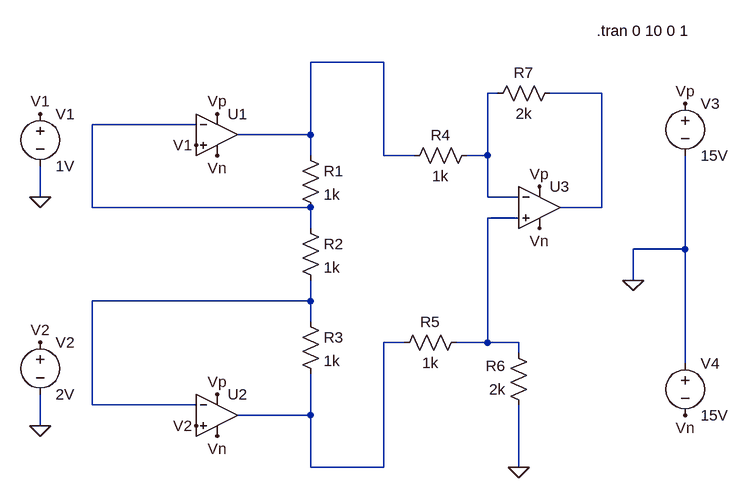
[diagram p0: schematic exp3.asc]
exp3.asc, the LTspice schematic file:
Version 4
SHEET 1 1000 680
WIRE 464 -64 352 -64
WIRE 640 -16 624 -16
WIRE 800 -16 720 -16
WIRE 176 32 16 32
WIRE 352 48 352 -64
WIRE 352 48 240 48
WIRE 352 80 352 48
WIRE 464 80 464 -64
WIRE 512 80 464 80
WIRE 624 80 624 -16
WIRE 624 80 592 80
WIRE -64 144 -64 96
WIRE 624 144 624 80
WIRE 672 144 624 144
WIRE 16 160 16 32
WIRE 352 160 16 160
WIRE 800 160 800 -16
WIRE 800 160 736 160
WIRE 672 176 624 176
WIRE 352 192 352 160
WIRE 928 224 928 80
WIRE 928 224 848 224
WIRE 848 272 848 224
WIRE 352 304 352 272
WIRE 352 304 16 304
WIRE 352 336 352 304
WIRE 496 368 464 368
WIRE 624 368 624 176
WIRE 624 368 576 368
WIRE 672 368 624 368
WIRE 672 384 672 368
WIRE 928 400 928 224
WIRE 16 464 16 304
WIRE 176 464 16 464
WIRE 352 480 352 416
WIRE 352 480 240 480
WIRE -64 496 -64 448
WIRE 352 560 352 480
WIRE 464 560 464 368
WIRE 464 560 352 560
WIRE 672 560 672 464
FLAG -64 144 0
FLAG -64 496 0
FLAG 672 560 0
FLAG 848 272 0
FLAG -64 16 V1
FLAG -64 368 V2
FLAG 208 16 Vp
FLAG 208 448 Vp
FLAG 928 0 Vp
FLAG 704 128 Vp
FLAG 208 80 Vn
FLAG 208 512 Vn
FLAG 704 192 Vn
FLAG 928 480 Vn
FLAG 176 64 V1
FLAG 176 496 V2
SYMBOL voltage -64 0 R0
WINDOW 123 0 0 Left 0
WINDOW 39 0 0 Left 0
SYMATTR InstName V1
SYMATTR Value 1V
SYMBOL voltage -64 352 R0
WINDOW 123 0 0 Left 0
WINDOW 39 0 0 Left 0
SYMATTR InstName V2
SYMATTR Value 2V
SYMBOL voltage 928 -16 R0
WINDOW 123 0 0 Left 0
WINDOW 39 0 0 Left 0
SYMATTR InstName V3
SYMATTR Value 15V
SYMBOL OpAmps\\UniversalOpAmp 208 48 R0
SYMATTR InstName U1
SYMBOL OpAmps\\UniversalOpAmp 208 480 R0
SYMATTR InstName U2
SYMBOL OpAmps\\UniversalOpAmp 704 160 R0
SYMATTR InstName U3
SYMBOL res 336 64 R0
SYMATTR InstName R1
SYMATTR Value 1k
SYMBOL res 336 176 R0
SYMATTR InstName R2
SYMATTR Value 1k
SYMBOL res 336 320 R0
SYMATTR InstName R3
SYMATTR Value 1k
SYMBOL res 608 64 R90
WINDOW 0 0 56 VBottom 2
WINDOW 3 32 56 VTop 2
SYMATTR InstName R4
SYMATTR Value 1k
SYMBOL res 592 352 R90
WINDOW 0 0 56 VBottom 2
WINDOW 3 32 56 VTop 2
SYMATTR InstName R5
SYMATTR Value 1k
SYMBOL res 688 480 R180
WINDOW 0 36 76 Left 2
WINDOW 3 36 40 Left 2
SYMATTR InstName R6
SYMATTR Value 2k
SYMBOL res 624 0 R270
WINDOW 0 32 56 VTop 2
WINDOW 3 0 56 VBottom 2
SYMATTR InstName R7
SYMATTR Value 2k
SYMBOL voltage 928 384 R0
WINDOW 123 0 0 Left 0
WINDOW 39 0 0 Left 0
SYMATTR InstName V4
SYMATTR Value 15V
TEXT 792 -112 Left 2 !.tran 0 10 0 1

The netlist it stands for:
* exp3.asc
V1 V1 0 1V
V2 V2 0 2V
V3 Vp 0 15V
XU1 V1 N004 Vp Vn N001 level1 Avol=1Meg GBW=10Meg Vos=0 En=0 Enk=0 In=0 Ink=0 Rin=500Meg  ; pins In+ In- V+ V- OUT
XU2 V2 N006 Vp Vn N007 level1 Avol=1Meg GBW=10Meg Vos=0 En=0 Enk=0 In=0 Ink=0 Rin=500Meg  ; pins In+ In- V+ V- OUT
XU3 N005 N002 Vp Vn N003 level1 Avol=1Meg GBW=10Meg Vos=0 En=0 Enk=0 In=0 Ink=0 Rin=500Meg  ; pins In+ In- V+ V- OUT
R1 N001 N004 1k
R2 N004 N006 1k
R3 N006 N007 1k
R4 N002 N001 1k
R5 N005 N007 1k
R6 0 N005 2k
R7 N002 N003 2k
V4 0 Vn 15V
.tran 0 10 0 1
.lib UniversalOpAmp1.lib
.backanno
.end